# EAGLE design main board v1.0 (EAGLE 9.6.2)
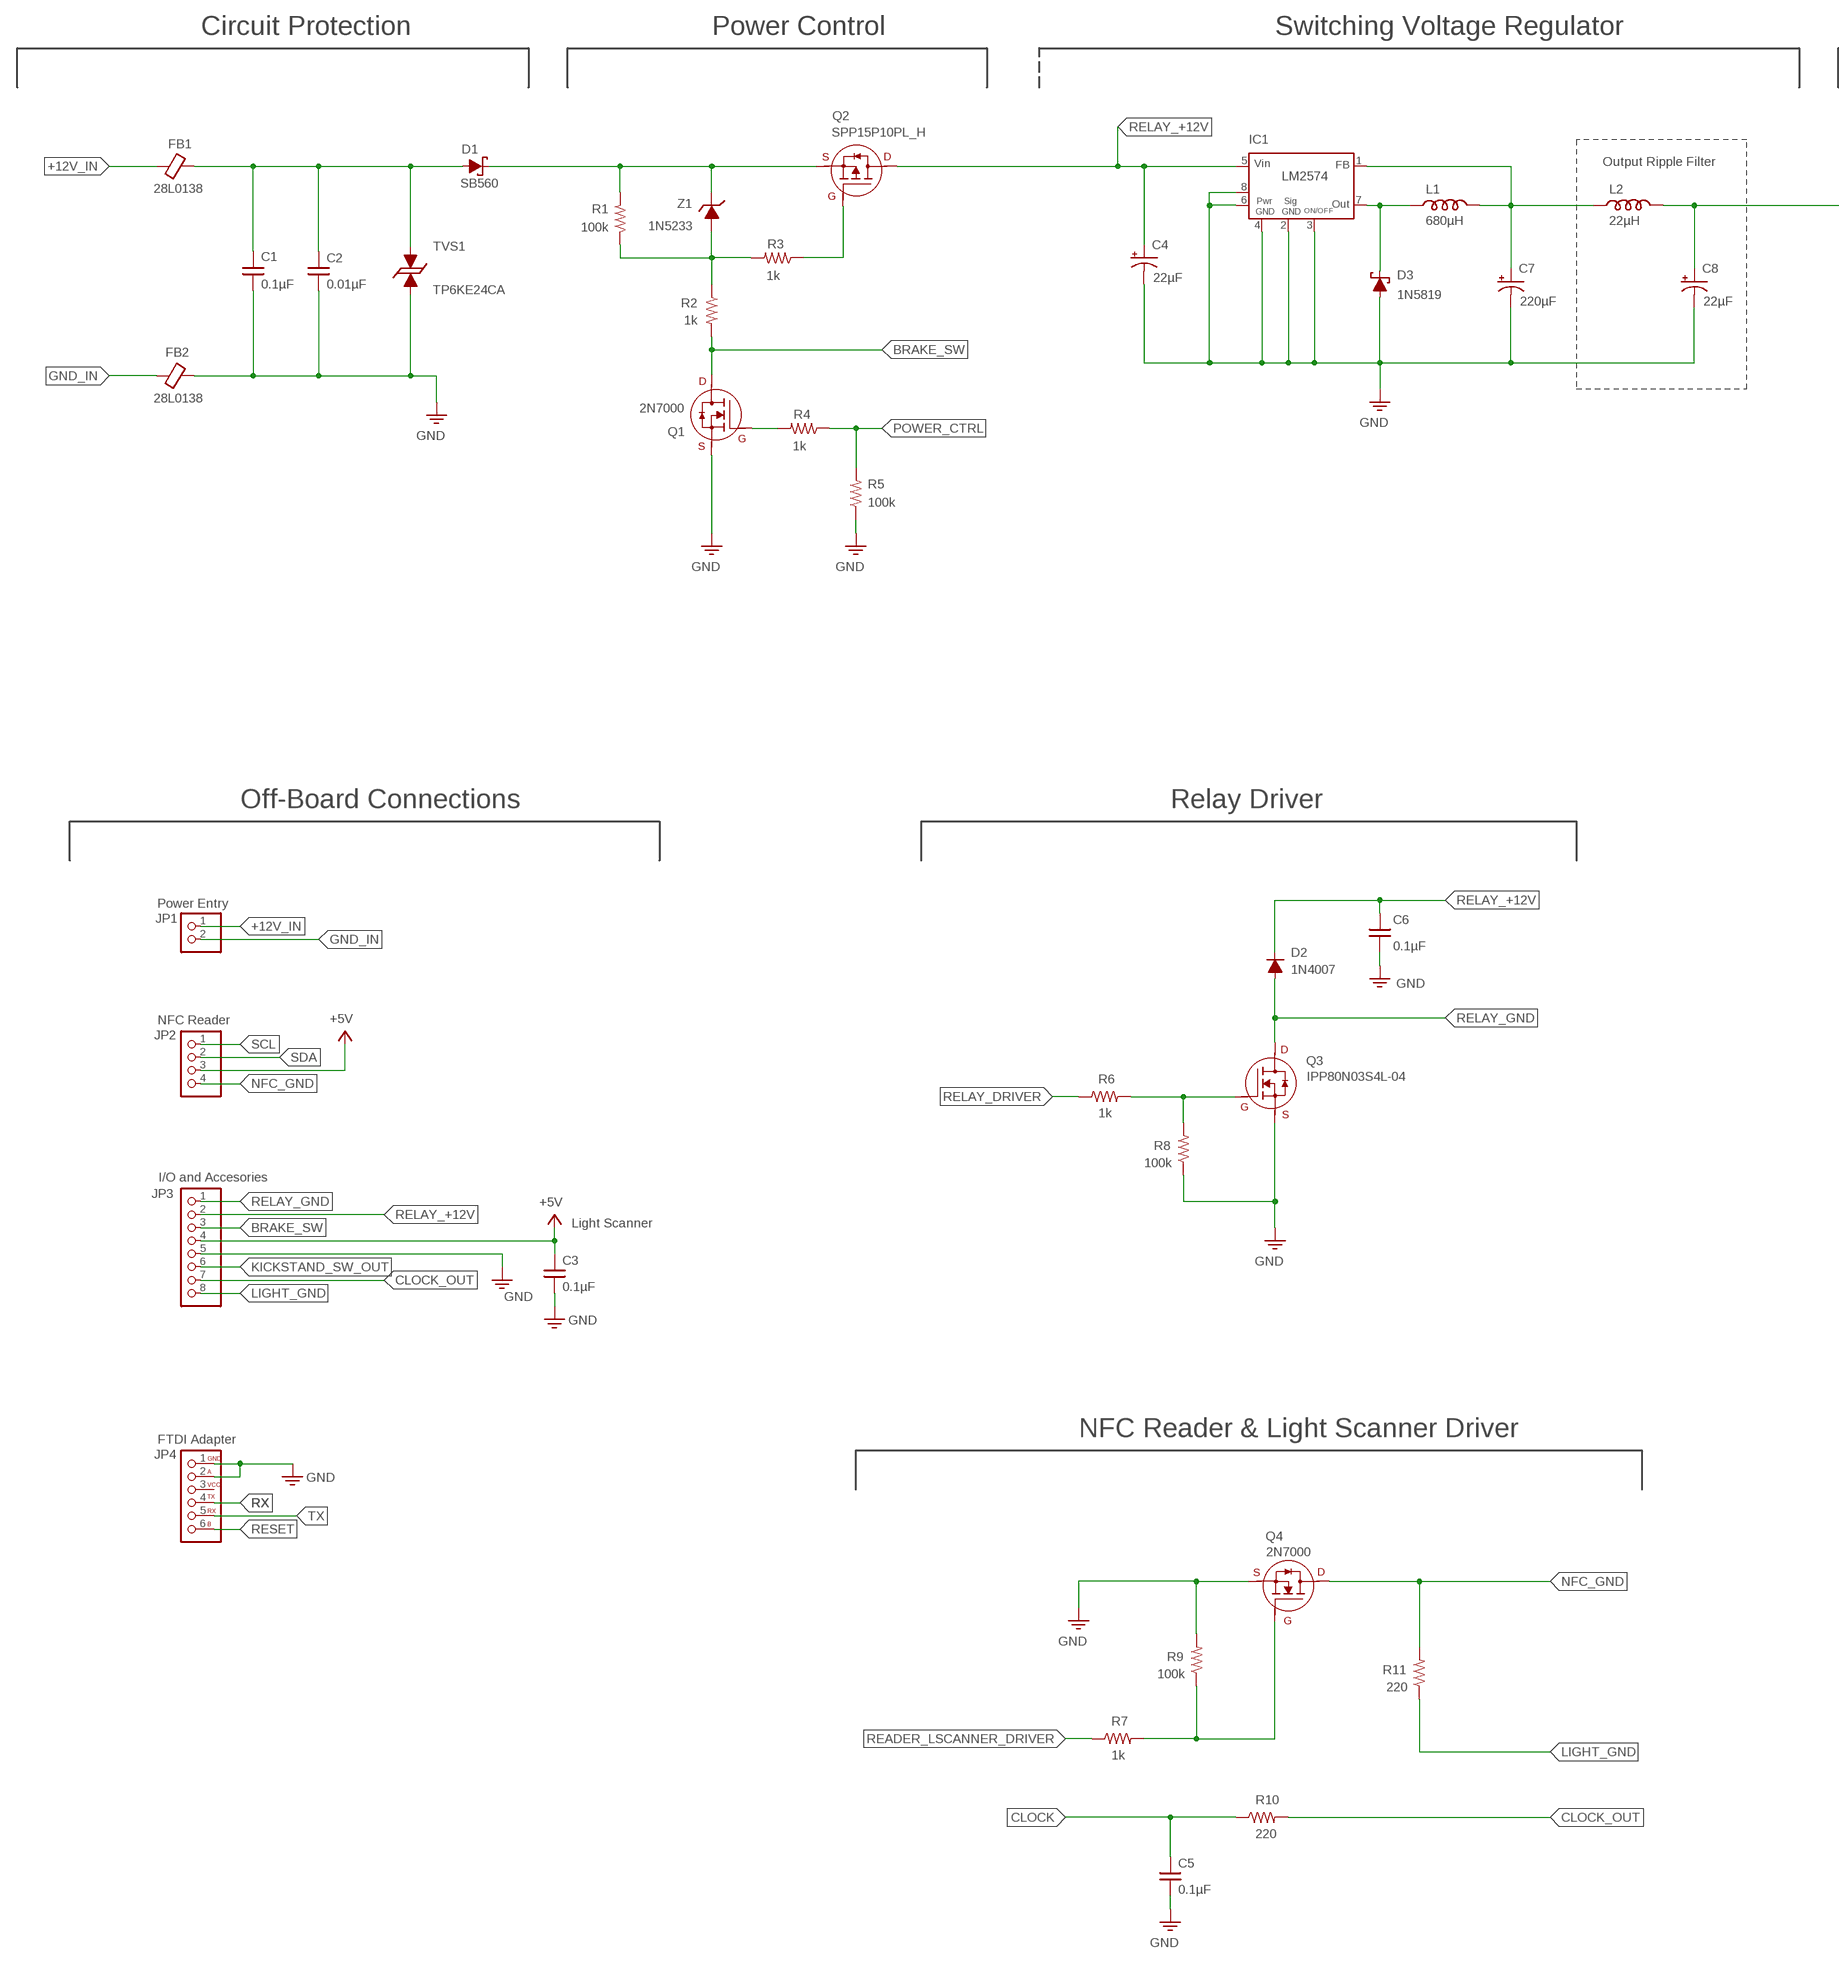
[diagram p0: schematic, sheet 1, part 1 of 2]
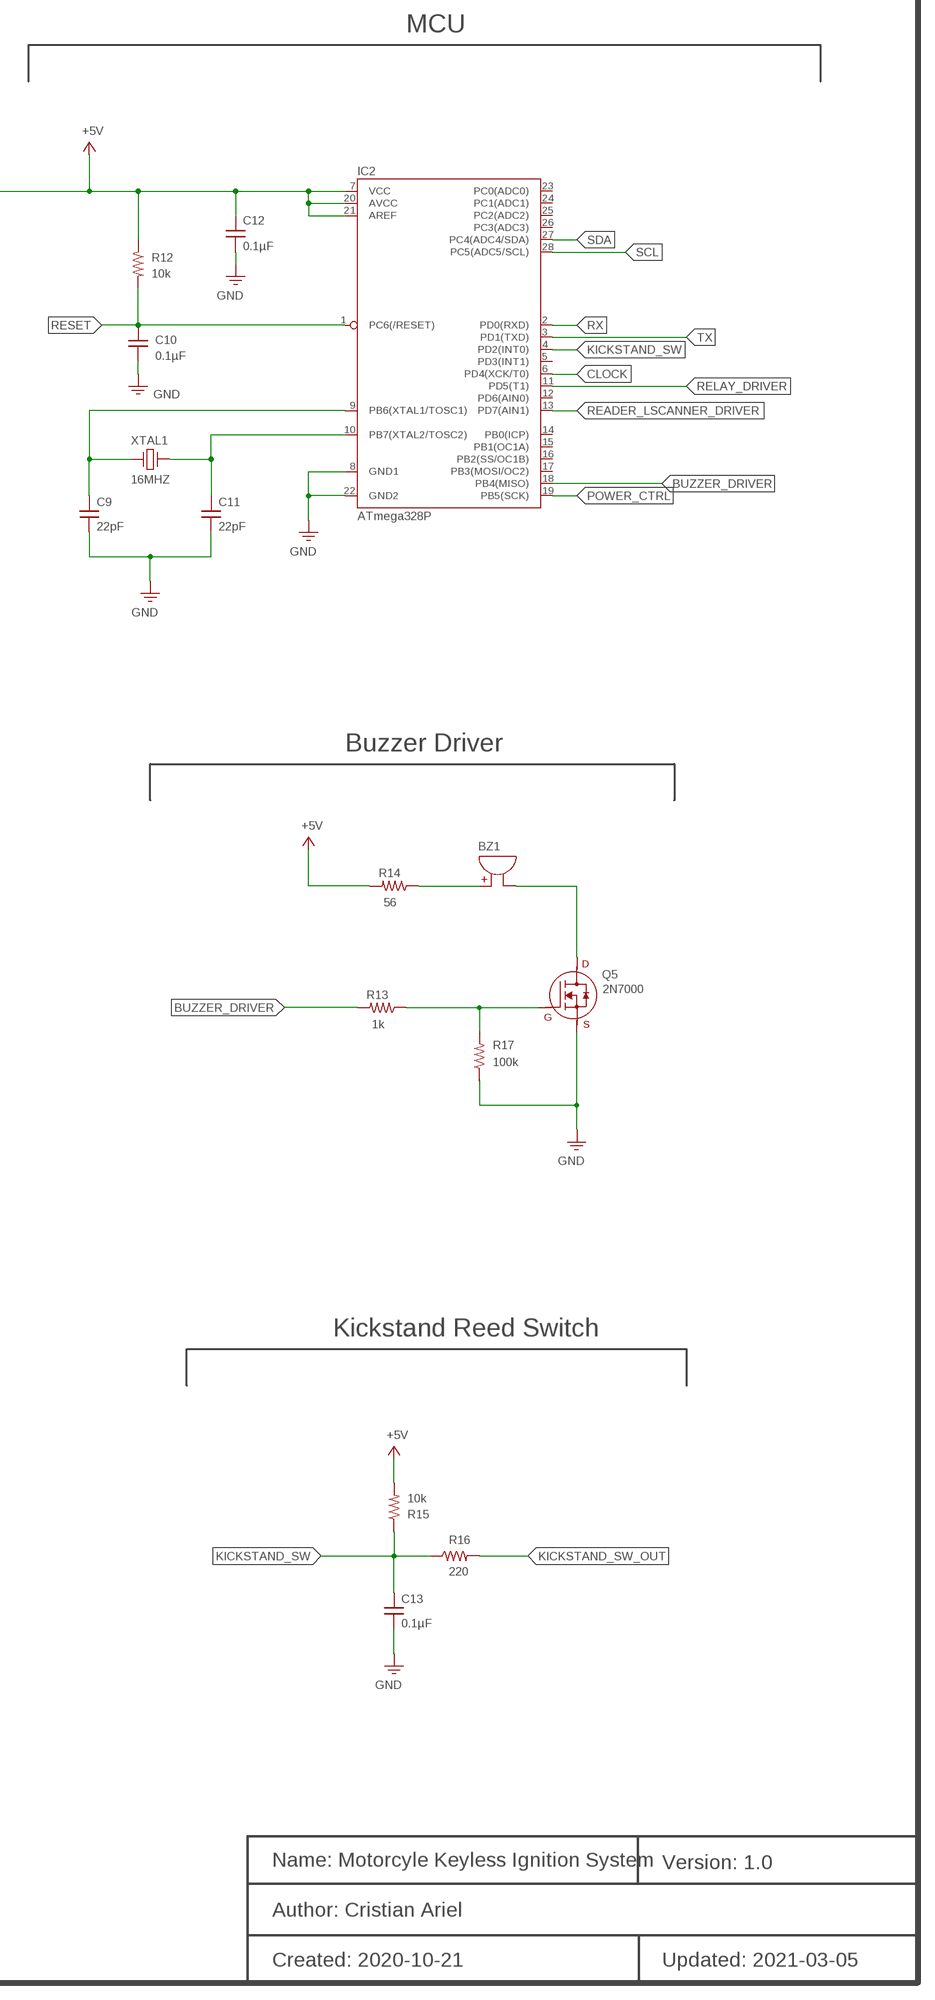
[diagram p1: schematic, sheet 1, part 2 of 2]

## Parts
BZ1  BUZZER_254-EMB15-RO  [BUZZER-12]
C1  0.1µF  C_K104K15X7RF53H5_0.1µF  [C_H5]
C2  0.01µF  C_FA24NP02E103JNU06_0.01µF  [C_H5]
C3  0.1µF  C_K104K15X7RF53H5_0.1µF  [C_H5]
C4  22µF  C_POLARIZED_UBT1H220MPD_22µF  [C_UBT_8]
C5  0.1µF  C_K104K15X7RF53H5_0.1µF  [C_H5]
C6  0.1µF  C_K104K15X7RF53H5_0.1µF  [C_H5]
C7  220µF  C_POLARIZED_UBT1C221MPD_220µF  [C_UBT_10]
C8  22µF  C_POLARIZED_UBT1H220MPD_22µF  [C_UBT_8]
C9  22pF  C_K220J10C0GF5UH5_22PF  [C_H5]
C10  0.1µF  C_K104K15X7RF53H5_0.1µF  [C_H5]
C11  22pF  C_K220J10C0GF5UH5_22PF  [C_H5]
C12  0.1µF  C_K104K15X7RF53H5_0.1µF  [C_H5]
C13  0.1µF  C_K104K15X7RF53H5_0.1µF  [C_H5]
D1  SB560  D_SCHOTTKY_SB560  [DO-201AD]
D2  1N4007  D_1N4007  [DO-41_(DO-204AL)]
D3  1N5819  D_SCHOTTKY_1N5819  [DO-204AL_(DO-41)]
FB1  28L0138  FERRITE_BEAD_28L0138  [FB-5.23]
FB2  28L0138  FERRITE_BEAD_28L0138  [FB-5.23]
IC1  LM2574  SWITCHING_REG_8_LM2574  [DIL08]
IC2  ATmega328P  ATMEGA328P_PDIP  [DIP28]
JP1  Power Entry  PINHD-1X2  [1X021]
JP2  NFC Reader  KK254_1X4  [KK254_1X4]
JP3  I/O and Accesories  PINHD-1X8  [1X08]
JP4  FTDI Adapter  FTDI_6  [1X06_FTDI]
L1  680µH  INDUCTOR_PE-52629NL_680µH  [PE-526]
L2  22µH  INDUCTOR_LTF5022-D_22µH  [LTF-D]
Q1  2N7000  MOSFET_NCH_V_2N7000  [TO-92]
Q2  SPP15P10PL_H  MOSFET_PCH_H_SPP15P10PL_H  [TO220]
Q3  IPP80N03S4L-04  MOSFET_NCH_V_IPP80N03S4L-04  [TO220]
Q4  2N7000  MOSFET_NCH_H_2N7000  [TO-92]
Q5  2N7000  MOSFET_NCH_V_2N7000  [TO-92]
R1  100k  R_THM  [R_THM]
R2  1k  R_THM  [R_THM]
R3  1k  R_THM  [R_THM]
R4  1k  R_THM  [R_THM]
R5  100k  R_THM  [R_THM]
R6  1k  R_THM  [R_THM]
R7  1k  R_THM  [R_THM]
R8  100k  R_THM  [R_THM]
R9  100k  R_THM  [R_THM]
R10  220  R_THM  [R_THM]
R11  220  R_THM  [R_THM]
R12  10k  R_THM  [R_THM]
R13  1k  R_THM  [R_THM]
R14  56  R_THM  [R_THM]
R15  10k  R_THM  [R_THM]
R16  220  R_THM  [R_THM]
R17  100k  R_THM  [R_THM]
TVS1  TP6KE24CA  D_TVS_BI_P6KE24CA  [DO-204AC_(DO-15)]
XTAL1  16MHZ  CRYSTAL_ECS-160-20-4X-DU_16MHZ  [HC-49USX]
Z1  1N5233  D_ZENER_1N5233_6V  [DO35-7A_ZENER]

## Nets
+5V: C3.1 C8.+ C12.1 IC2.7(VCC) IC2.20(AVCC) IC2.21(AREF) JP2.3 JP3.4 L2.1(END) R12.1 R14.2 R15.2
+12V_IN: FB1.1 JP1.1
BRAKE_SW: JP3.3 Q1.3(D) R2.2
BUZZER_DRIVER: IC2.18(PB4(MISO)) R13.2
CLOCK: C5.1 IC2.6(PD4(XCK/T0)) R10.1
CLOCK_OUT: JP3.7 R10.2
GND: C1.2 C2.2 C3.2 C4.- C5.2 C6.2 C7.- C8.- C9.2 C10.2 C11.2 C12.2 C13.2 D3.A FB2.2 IC1.2(SIG_GND) IC1.3(ON/OFF) IC1.4(PWR_GND) IC1.6 IC1.8 IC2.8(GND1) IC2.22(GND2) JP3.5 JP4.1 JP4.2 Q1.1(S) Q3.3(S) Q4.1(S) Q5.1(S) R5.1 R8.1 R9.2 R17.1 TVS1.2
GND_IN: FB2.1 JP1.2
KICKSTAND_SW: C13.1 IC2.4(PD2(INT0)) R15.1 R16.1
KICKSTAND_SW_OUT: JP3.6 R16.2
LIGHT_GND: JP3.8 R11.1
N$1: BZ1.+ R14.1
N$2: Q1.2(G) R4.2
N$5: D1.C Q2.3(S) R1.2 Z1.C
N$6: Q2.1(G) R3.1
N$7: R1.1 R2.1 R3.2 Z1.A
N$9: C9.1 IC2.9(PB6(XTAL1/TOSC1)) XTAL1.1
N$10: Q5.2(G) R13.1 R17.2
N$12: D3.C IC1.7(OUT) L1.1(START)
N$13: C7.+ IC1.1(FB) L1.2(END) L2.2(START)
N$14: C11.1 IC2.10(PB7(XTAL2/TOSC2)) XTAL1.2
N$16: Q3.1(G) R6.2 R8.2
N$17: Q4.2(G) R7.2 R9.1
N$18: BZ1.- Q5.3(D)
N$20: C1.1 C2.1 D1.A FB1.2 TVS1.1
NFC_GND: JP2.4 Q4.3(D) R11.2
POWER_CTRL: IC2.19(PB5(SCK)) R4.1 R5.2
READER_LSCANNER_DRIVER: IC2.13(PD7(AIN1)) R7.1
RELAY_+12V: C4.+ C6.1 D2.C IC1.5(VIN) JP3.2 Q2.2(D)
RELAY_DRIVER: IC2.11(PD5(T1)) R6.1
RELAY_GND: D2.A JP3.1 Q3.2(D)
RESET: C10.1 IC2.1(PC6(/RESET)) JP4.6 R12.2
RX: IC2.2(PD0(RXD)) JP4.4
SCL: IC2.28(PC5(ADC5/SCL)) JP2.1
SDA: IC2.27(PC4(ADC4/SDA)) JP2.2
TX: IC2.3(PD1(TXD)) JP4.5
Unconnected: IC2.5(PD3(INT1)) IC2.12(PD6(AIN0)) IC2.14(PB0(ICP)) IC2.15(PB1(OC1A)) IC2.16(PB2(SS/OC1B)) IC2.17(PB3(MOSI/OC2)) IC2.23(PC0(ADC0)) IC2.24(PC1(ADC1)) IC2.25(PC2(ADC2)) IC2.26(PC3(ADC3)) JP4.3

## Notes on the sheet
- Circuit Protection | Power Control | Switching Voltage Regulator | MCU
- Output Ripple Filter
- Off-Board Connections | Relay Driver | Buzzer Driver
- Light Scanner
- NFC Reader & Light Scanner Driver | Kickstand Reed Switch
- Name: Motorcyle Keyless Ignition System | Version: 1.0
- Author: Cristian Ariel
- Created: 2020-10-21 | Updated: 2021-03-05

## Library data of the parts
BZ1 = Assys Complex:BUZZER_: BUZZERS
C1-C3 C5 C6 C9-C13 = Assys Complex:C_: CAPACITORS
C4 C7 C8 = Assys Complex:C_POLARIZED_: POLARIZED CAPACITORS
D1 D3 = Assys Complex:D_SCHOTTKY_: SCHOTTKY DIODES
D2 = Assys Complex:D_: DIODES
FB1 FB2 = Assys Complex:FERRITE_BEAD_: FERRITE BEADS
IC1 = Assys Complex:SWITCHING_REG_8_: Switching Regulators
IC2 = Assys Complex:ATMEGA328P_: Atmel 328P Through hole ATMEGA328P uC used in the Arduino 32kb flash, 1k EEPROM, 2k SRAM Datasheet <http://www.sparkfun.com/datasheets/Components/SMD/ATMega328.pdf> SparkFun Products Storefront component: AVR 28 Pin 20MHz 32K 6A/D - ATMega328P <https://www.sparkfun.com/products/9061> (COM-09061) SparkFun Simon Says - Through-Hole Soldering Kit <https://www.sparkfun.com/products/10547> (KIT-10547) SparkFun Learn to Solder - Simon Says <https://www.sparkfun.com/products/13708> (KIT-13708) SparkFun BigTime Watch Kit <https://www.sparkfun.com/products/11734> (KIT-11734) SparkFun ClockIt <https://www.sparkfun.com/products/10930> (KIT-10930) SparkFun Serial Enabled LCD Kit <https://www.sparkfun.com/products/10097> (LCD-10097) SparkFun Simon Tilts - Through Hole Soldering Kit <https://www.sparkfun.com/products/12634> (KIT-12634) SparkFun Frequency Counter Kit <https://www.sparkfun.com/products/10140> (KIT-10140) FabFM Radio Kit <https://www.sparkfun.com/products/11043> (KIT-11043) SparkFun Binary Blaster Kit <https://www.sparkfun.com/products/12037> (KIT-12037) SparkFun Metro-Gnome <https://www.sparkfun.com/products/9236> (KIT-09236) ATmega328 with Arduino Optiboot (Uno) <https://www.sparkfun.com/products/10524> (DEV-10524); PROD_ID: IC-09136; VALUE: 328P
JP1 = Assys Complex:PINHD-1X2: PIN HEADER
JP2 = Assys Complex:KK254_1X4: PIN HEADER
JP3 = Assys Complex:PINHD-1X8: PIN HEADER
JP4 = Assys Complex:FTDI_6: FTID PIN HEADER
L1 L2 = Assys Complex:INDUCTOR_: INDUCTORS
Q1 Q3 Q5 = Assys Complex:MOSFET_NCH_V_: N-CHANNEL MOSFET Vertical Symbol
Q2 = Assys Complex:MOSFET_PCH_H_: P-CHANNEL MOSFET Horizontal Symbol
Q4 = Assys Complex:MOSFET_NCH_H_: N-CHANNEL MOSFET Horizontal Symbol
R1-R17 = Assys Complex:R_: Resistors
TVS1 = Assys Complex:D_TVS_BI_: Bi-directional TVS Diodes
XTAL1 = Assys Complex:CRYSTAL_: CRYSTALS; FREQUENCY: 16 MHZ
Z1 = Assys Complex:D_ZENER_: ZENER DIODES

## Board
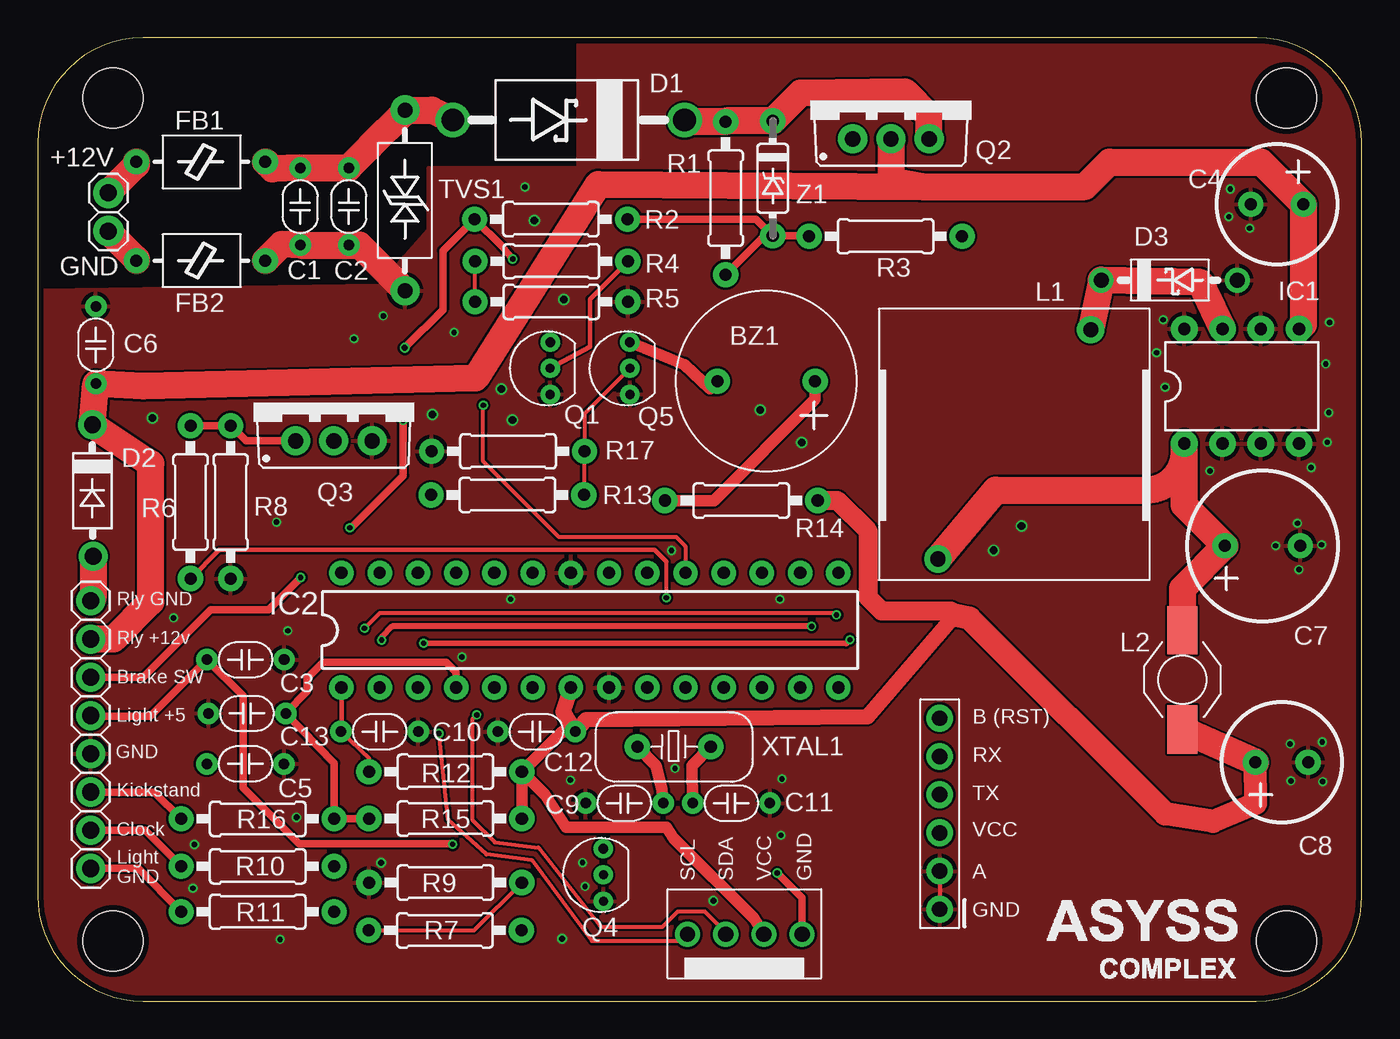
[diagram p2: board, top side]
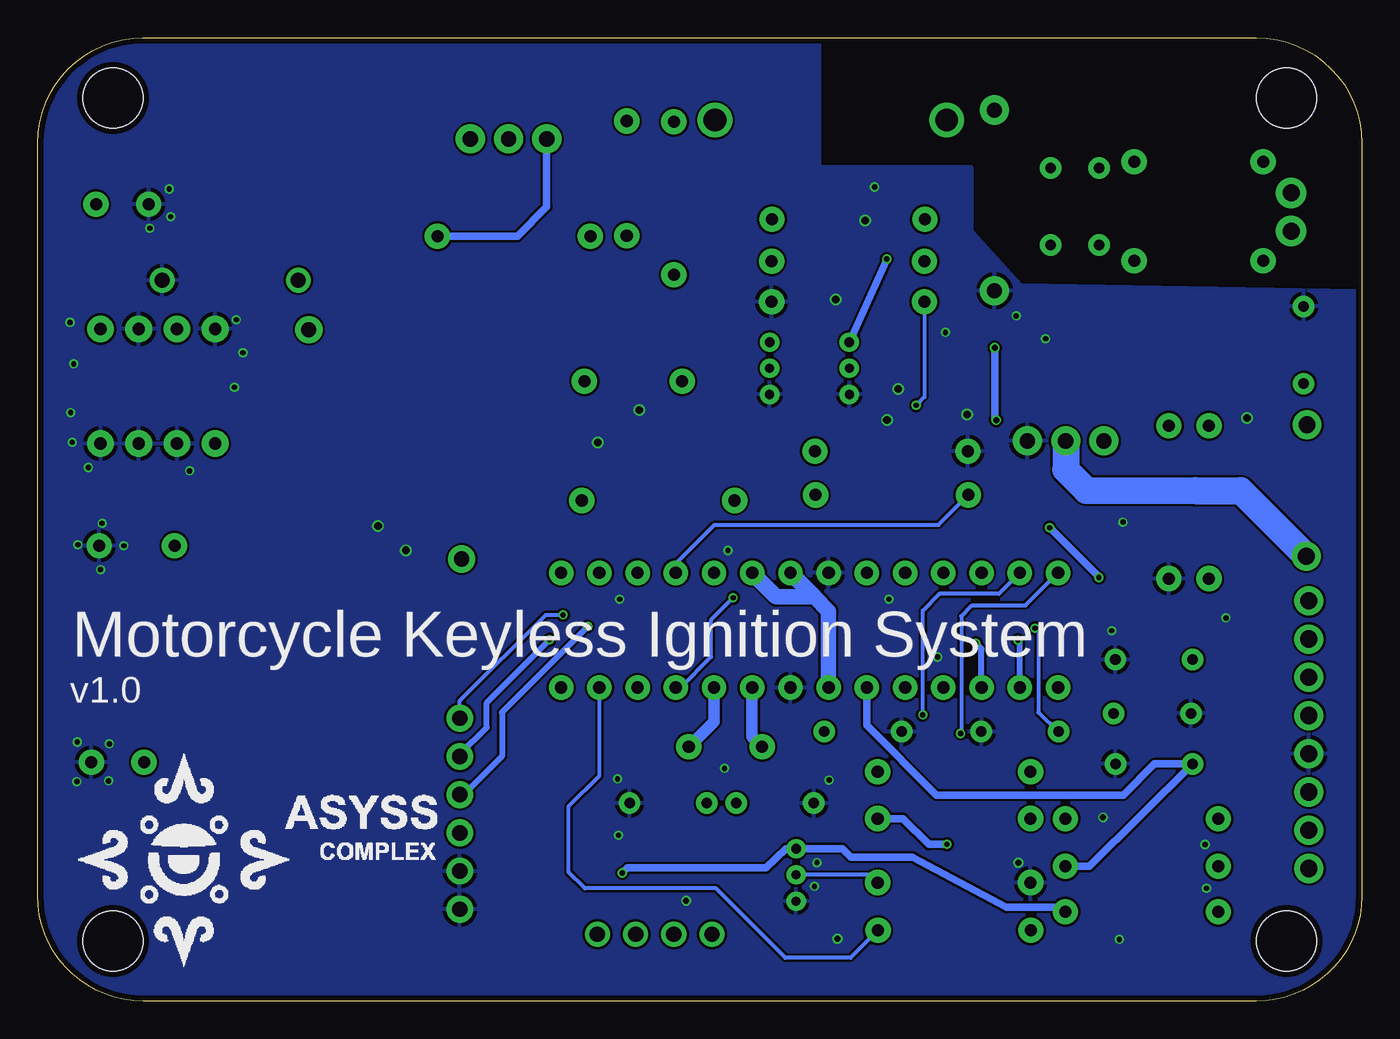
[diagram p3: board, bottom side, seen from below]

Size 88 x 64 mm. Coordinates in mm from the lower left corner, seen from the top.
Outline: 7,0 81,0 arc90 88,7 88,57 arc90 81,64 7,64 arc90 0,57 0,7 arc90 7,0
Copper layers (1*16): Top 0.035559375mm / dielectric 1.6mm / Bottom 0.035559375mm
Design rules "oshpark-2layer *": minimum track width 6mil, minimum drill 10mil, track to track 6mil, track to pad 6mil, pad to pad 6mil, via to via 6mil, smd to smd 6mil, copper to edge 15mil, drill to drill 6mil, minimum pad ring 5mil, minimum via ring 5mil, stop-mask expansion 2.5mil, vias tented up to drill 21mil, thermal gap 10mil
Holes 4 mm at 5,4 5,60 83,60 83,4

### Footprints (pad centres in the part's own frame; a part is rotated, then mirrored left to right if it is on the bottom)
BUZZER-12 = drill 0.8 pad 1.676: + -3.25,0; - 3.25,0
C_H5 = drill 0.7 pad 1.422: 1 -2.576,0; 2 2.563,0
C_UBT_8 = drill 0.8 pad 1.676: + 1.75,0; - -1.75,0
C_UBT_10 = drill 0.8 pad 1.676: + 2.5,0; - -2.5,0
DO-201AD = drill 1.5 pad 2.3: A 7.57,0; C -7.82,0
DO-41_(DO-204AL) = drill 1.118 pad 1.905: A 4.369,0.051; C -4.369,0
DO-204AL_(DO-41) = drill 1 pad 1.651: A 4.47,0; C -4.572,0
FB-5.23 = drill 0.8 pad 1.676: 1 -4.332,0; 2 4.235,0
DIL08 = drill 0.813 pad 1.778: 1 -3.81,-3.81; 2 -1.27,-3.81; 3 1.27,-3.81; 4 3.81,-3.81; 5 3.81,3.81; 6 1.27,3.81; 7 -1.27,3.81; 8 -3.81,3.81
DIP28 = drill 0.813 pad 1.626: 1 -16.51,-3.81; 2 -13.97,-3.81; 3 -11.43,-3.81; 4 -8.89,-3.81; 5 -6.35,-3.81; 6 -3.81,-3.81; 7 -1.27,-3.81; 8 1.27,-3.81; 9 3.81,-3.81; 10 6.35,-3.81; 11 8.89,-3.81; 12 11.43,-3.81; 13 13.97,-3.81; 14 16.51,-3.81; 15 16.51,3.81; 16 13.97,3.81; 17 11.43,3.81; 18 8.89,3.81; 19 6.35,3.81; 20 3.81,3.81; 21 1.27,3.81; 22 -1.27,3.81; 23 -3.81,3.81; 24 -6.35,3.81; 25 -8.89,3.81; 26 -11.43,3.81; 27 -13.97,3.81; 28 -16.51,3.81
1X021 = drill 1.143 pad 2.032: 1 -1.27,0; 2 1.27,0
KK254_1X4 = drill 1.016 pad 1.676: 1 -3.81,0; 2 -1.27,0; 3 1.27,0; 4 3.81,0
1X08 = drill 1.143 pad 1.93: 1 -8.89,0; 2 -6.35,0; 3 -3.81,0; 4 -1.27,0; 5 1.27,0; 6 3.81,0; 7 6.35,0; 8 8.89,0
1X06_FTDI = drill 1.016 pad 1.778: 1 -6.35,0; 2 -3.81,0; 3 -1.27,0; 4 1.27,0; 5 3.81,0; 6 6.35,0
PE-526 = drill 1 pad 1.8: 1 -5.08,-7.62; 2 5.08,7.62
LTF-D = smd 3.2 x 2: 1 -3.312,0; 2 3.292,0
TO-92 = drill 0.6 pad 1.27: 1 1.74,0; 2 0,0 | drill 0.65 pad 1.27: 3 -1.74,0
TO220 = drill 1.016 pad 1.93: 1 -2.54,-2.54; 2 0,-2.54; 3 2.54,-2.54
R_THM = drill 0.8 pad 1.676: 1 -5.08,0; 2 5.08,0
DO-204AC_(DO-15) = drill 1 pad 1.93: 1 -6,0; 2 6,0
HC-49USX = drill 0.8 pad 1.676: 1 -2.44,0; 2 2.44,0
DO35-7A_ZENER = drill 0.813 pad 1.676: A 3.81,0; C -3.81,0

### Placement (x,y rotation side)
BZ1  48.42,41.18 180 top
C1  17.45,52.78 270 top
C2  20.68,52.78 270 top
C3  13.82,22.68 0 top
C4  82.37,52.93 0 top
C5  13.82,15.76 0 top
C6  3.87,43.59 90 top
C7  81.41,30.24 180 top
C8  82.68,15.86 180 top
C9  38.99,13.15 180 top
C10  22.73,17.91 0 top
C11  46.1,13.15 0 top
C12  33.15,17.91 180 top
C13  13.92,19.11 180 top
D1  35.17,58.52 180 top
D2  3.64,33.92 270 top
D3  75.25,47.89 0 top
FB1  10.9,55.75 0 top
FB2  10.9,49.19 0 top
IC1  80.01,40.84 0 top
IC2  36.7,24.64 0 top
JP1  4.7,52.42 270 top
JP2  46.99,4.45 0 top
JP3  3.52,17.7 270 top
JP4  59.94,12.45 90 top
L1  64.9,36.99 180 top
L2  76.07,21.35 90 top
Q1  34.07,42.04 270 top
Q2  56.7,59.82 0 top
Q3  19.68,39.75 0 top
Q4  37.59,8.38 270 top
Q5  39.35,42.04 270 top
R1  45.72,53.34 90 top
R2  34.12,51.94 180 top
R3  56.35,50.81 180 top
R4  34.14,49.15 0 top
R5  34.14,46.45 180 top
R6  10.16,33.15 90 top
R7  27.07,4.7 180 top
R8  12.83,33.15 90 top
R9  27.1,7.87 180 top
R10  14.62,8.96 180 top
R11  14.62,5.93 0 top
R12  27.1,15.24 180 top
R13  31.22,33.62 180 top
R14  46.76,33.26 0 top
R15  27.1,12.13 0 top
R16  14.62,12.11 180 top
R17  31.26,36.52 0 top
TVS1  24.41,53.19 270 top
U$1  [ASSYS_COMP_LOGO_V5]  78.4,9.2 0 bottom
U$2  [ASSYS_COMP_LOGO_V6]  73.5,3.58 0 top
XTAL1  42.29,16.89 0 top
Z1  48.85,54.66 270 top

### Tracks (layer width: path | path; a pad name or v marks a point on that pad's centre or on a via)
+5V  (via drill 0.35)
  Top 0.508: v27.58,10.42 27.54,10.46 17.36,10.46 13.65,14.17 13.65,20.27 C3.1 7.49,18.93 3.56,18.93 JP3.4
  Top 0.762: R12.1 33.72,13.7 35.12,11.54 41.81,11.53 42.26,10.83 47.59,5.49 JP2.3 | C12.1 34.84,17.91 R12.1 | R12.1 R15.2
  Top 1.016: 60.94,25.64 55.14,18.9 36.44,18.7 C12.1 34.93,19.23 IC2.7
  Top 1.27: 60.94,25.64 60.68,25.9 56.1,25.9 55.2,26.8 55.2,31.2 53.15,33.26 R14.2
  Top 1.524: 60.94,25.64 61.93,25.45 74.93,12.45 78.11,11.94 80.94,13.13 C8.+
  Top 1.778: C8.+ L2.1
  Bottom 0.508: v27.58,10.42 28.78,10.42 30.49,12.13 R15.2
  Bottom 1.016: IC2.7 35.43,25.91 36.39,26.86 | 36.39,26.86 IC2.21 | 36.39,26.86 38.92,26.86 IC2.20
+12V_IN
  Top 1.778: JP1.1 6.57,55.56 FB1.1
BRAKE_SW  (via drill 0.35, 0.4)
  Top 0.508: v31.57,49.3 30.85,50.13 R2.2 26.94,49.85 26.94,45.94 v24.4,43.4 | v20.75,31.45 20.8,31.4 24.3,34.9 v24.3,38.6 | JP3.3 7.01,21.51 11.5,26 15.34,26 v17.48,28.14
  Bottom 0.508: v24.4,43.4 24.4,38.7 v24.3,38.6 | v31.57,49.3 Q1.3 | v20.75,31.45 17.48,28.18 v17.48,28.14
BUZZER_DRIVER
  Bottom 0.254: R13.2 28.13,31.64 43.04,31.64 45.59,29.08 IC2.18
CLOCK
  Bottom 0.508: IC2.6 32.89,18.32 28.27,13.69 15.86,13.69 13.79,15.76 C5.1 18.12,8.96 R10.1
CLOCK_OUT
  Top 0.508: R10.2 7.15,11.35 JP3.7
GND  (via drill 0.35, 0.4, 0.51)
  Top 0.254: JP4.2 JP4.1
  Top 1.778: FB2.2 16.21,50.27 C1.2 C2.2 21.39,50.22 TVS1.2
  other vias: 32.38,54.08 22.97,45.52 21.02,44 26.22,38.97 34.96,46.61 33,51.85 7.62,38.73 83.72,31.75 74.36,43.07 74.8,45.26 85.7,37.13 79.16,52.11 79.25,53.95 80.54,51.33 85.8,39.09 74.92,40.79 85.33,30.32 83.82,28.66 82.27,30.24 83.23,17.09 85.39,14.58 83.28,14.63 85.36,17.21 9.03,25.45 85.6,42.33 85.85,45.09 77.91,35.22 84.63,35.45 31.56,38.6 30.81,40.66 28.19,22.86 36.38,7.62 17.2,12.2 22.82,9.2 34.86,4.14 44.9,6.66 27.67,44.42 15.87,31.82 31.42,26.7 49.32,26.7 35.4,14.68 16.12,4.1 10.42,10.4 10.32,7.5 16.62,24.6 49.46,14.76 49.4,11.02 42.36,15.46 42.12,29.93 36.22,9.2 48.02,39.27 50.78,37.11 65.38,31.56 63.53,29.95
  pour Top: 35.95,63.95 80.2,63.95 arc-90 88.2,55.95 88.2,7.05 arc-90 80.9,-0.25 7.25,-0.25 arc-90 0.25,6.75 0.25,47.23 22.74,47.55 25.98,51.26 25.98,55.37 35.95,55.37
  pour Bottom: 0.26,47.2 0.15,7 arc90 7.25,-0.13 80.64,-0.13 arc90 88.2,7.43 88.2,55.95 arc90 80.3,63.85 36.07,63.85 36.07,55.41 25.96,55.41 25.94,51.16 22.71,47.59
GND_IN
  Top 1.778: FB2.1 6.57,49.28 JP1.2
KICKSTAND_SW
  Top 0.508: IC2.4 27.81,21.84 27.14,22.52 18.96,22.52 17.91,21.46 17.91,20.59 C13.1 19.7,15.81 R16.1 19.73,12.13 R15.1
KICKSTAND_SW_OUT
  Top 0.508: R16.2 7.76,13.89 JP3.6
LIGHT_GND
  Top 0.508: R11.1 6.67,8.81 JP3.8
N$1
  Top 0.762: R14.1 44.95,33.26 51.67,39.97 BZ1.+
N$2
  Top 0.305: Q1.2 36.7,43.48 36.7,46.63 R4.2
N$5
  Top 1.778: Q2.3 59.24,58.79 57.64,60.4 50.7,60.31 Z1.C 45.77,58.47 R1.2 43.09,58.42 D1.C
N$6
  Bottom 0.508: R3.1 56.11,50.81 54.16,52.76 Q2.1
N$7
  Top 0.508: Z1.A 47.75,51.94 R2.1 | R3.2 51.2,50.85 Z1.A | R1.1 48.31,50.85 Z1.A
N$9
  Top 0.762: XTAL1.1 41.11,15.64 41.51,14.03 C9.1
  Bottom 0.762: IC2.9 40.51,17.55 XTAL1.1
N$10
  Top 0.254: R13.1 36.3,36.48 R17.2 36.34,39.02 Q5.2
N$12
  Top 1.778: IC1.7 77.26,47.74 D3.C 70.7,47.87 L1.1
N$13
  Top 1.778: L1.2 63.68,33.95 73.66,33.95 arc90 76.2,36.49 IC1.1 76.2,32.95 C7.+ 76.07,27.41 L2.2
N$14
  Top 0.762: XTAL1.2 43.47,15.63 C11.1
  Bottom 0.762: IC2.10 43.05,18.57 XTAL1.2
N$16
  Top 0.508: R6.2 R8.2 13.84,37.21 Q3.1
N$17
  Top 0.254: R7.2 29,4.7 R9.1
  Bottom 0.254: R9.1 32.69,8.38 Q4.2
N$18
  Top 0.762: Q5.3 42.99,42.28 44.68,40.69 BZ1.-
N$20
  Top 1.778: D1.A 26.2,59.19 TVS1.1 24.41,59.09 22.03,56.71 C2.1 C1.1 15.61,55.28 FB1.2
NFC_GND  (via drill 0.35)
  Top 0.508: v49.15,8.51 50.8,6.86 JP2.4
  Bottom 0.508: v49.15,8.51 48.81,8.85 39.58,8.85 38.28,10.12 Q4.3 34.51,10.12 33.96,9.57 29.86,9.56 23.61,6.23 20,6.23 R11.2
POWER_CTRL  (via drill 0.35)
  Top 0.254: IC2.19 43.05,30.21 42.45,30.82 34.65,30.82 29.62,35.86 v29.62,39.58 | R5.2 R4.1
  Bottom 0.254: R5.2 29.06,40.13 v29.62,39.58
READER_LSCANNER_DRIVER
  Bottom 0.254: R7.1 33.97,2.88 38.31,2.88 42.93,7.49 51.62,7.49 52.7,8.57 52.7,12.95 50.67,14.99 IC2.13
RELAY_+12V
  Top 1.778: IC1.5 84.12,44.95 C4.+ 81.32,55.74 71.23,55.74 69.6,54.1 58.74,54.1 | 58.74,54.1 37.25,54.26 29.09,41.39 7.03,40.86 C6.1 D2.C 7.52,35.71 7.52,26.52 5.05,24.05 JP3.2 | Q2.2 56.7,54.45 58.74,54.1
RELAY_DRIVER  (via drill 0.35)
  Top 0.254: v41.78,26.8 41.78,29.19
  Top 0.305: R6.1 12.06,29.97 41,29.97 41.78,29.19
  Bottom 0.254: v41.78,26.8 43.25,25.33 43.25,22.87 45.29,20.83 IC2.11
RELAY_GND
  Top 1.778: D2.A 3.69,26.76 JP3.1
  Bottom 1.778: Q3.2 19.68,35.31 18.31,33.93 11.09,33.91 8.05,33.91 D2.A
RESET  (via drill 0.35)
  Top 0.254: v21.72,24.77 22.73,25.78 52.96,25.78 v53.09,25.65 | C10.1 22.02,16.14 R12.2
  Top 0.305: IC2.1 20.23,20.79 C10.1
  Bottom 0.254: JP4.6 59.94,19.94 54.23,25.65 v53.09,25.65 | v21.72,24.77 21.51,24.56 21.51,19.19 C10.1
RX  (via drill 0.35)
  Top 0.406: v51.44,24.89 23.57,24.89 22.86,24.18 v22.86,23.98
  Bottom 0.254: 59.69,13.72 JP4.4
  Bottom 0.305: 22.73,23.98 v22.86,23.98
  Bottom 0.406: IC2.2 22.73,23.98 | v51.44,24.89 57.15,19.18 57.15,16.26 59.69,13.72
SCL  (via drill 0.35)
  Top 0.254: v26.67,17.78 27.29,12.06 29.82,9.74 32.87,9.35 36.83,3.99 42.72,3.99 JP2.1
  Bottom 0.254: 26.62,17.78 26.62,25.58 25.91,26.29 22.35,26.29 IC2.28
  Bottom 0.305: 26.62,17.78 v26.67,17.78
SDA  (via drill 0.35)
  Top 0.254: v29.18,19.02 28.88,18.71 28.88,12.05 30.39,10.55 33.28,10.2 37.32,5.08 37.45,4.95 41.53,4.95 42.55,5.97 44.32,5.97 45.72,4.57 JP2.2
  Bottom 0.254: v29.18,19.02 29.18,25.93 28.07,27.05 24.13,27.05 IC2.27
TX  (via drill 0.35)
  Top 0.406: v25.65,23.77 53.72,23.75 v53.98,24
  Bottom 0.254: JP4.5 59.94,16.38
  Bottom 0.406: IC2.3 25.27,23.39 v25.65,23.77 | 59.94,16.38 58.17,18.16 58.17,19.81 v53.98,24

### Text on the board
tPlace: +12V | GND | Rly GND | Rly +12v | Brake SW | Light +5 | B (RST) | GND | RX | Kickstand | TX | Clock | VCC | Light | GND | SCL | SDA | VCC | GND | A | GND
bPlace: Motorcycle Keyless Ignition System | v1.0
200bmp: D:/A Moving Bin/Silk.bmp | D:/A Moving Bin/Silk.bmp | D:/A Moving Bin/Silk.bmp